# EAGLE board flight_controller_v1.0 (EAGLE 9.7.0)
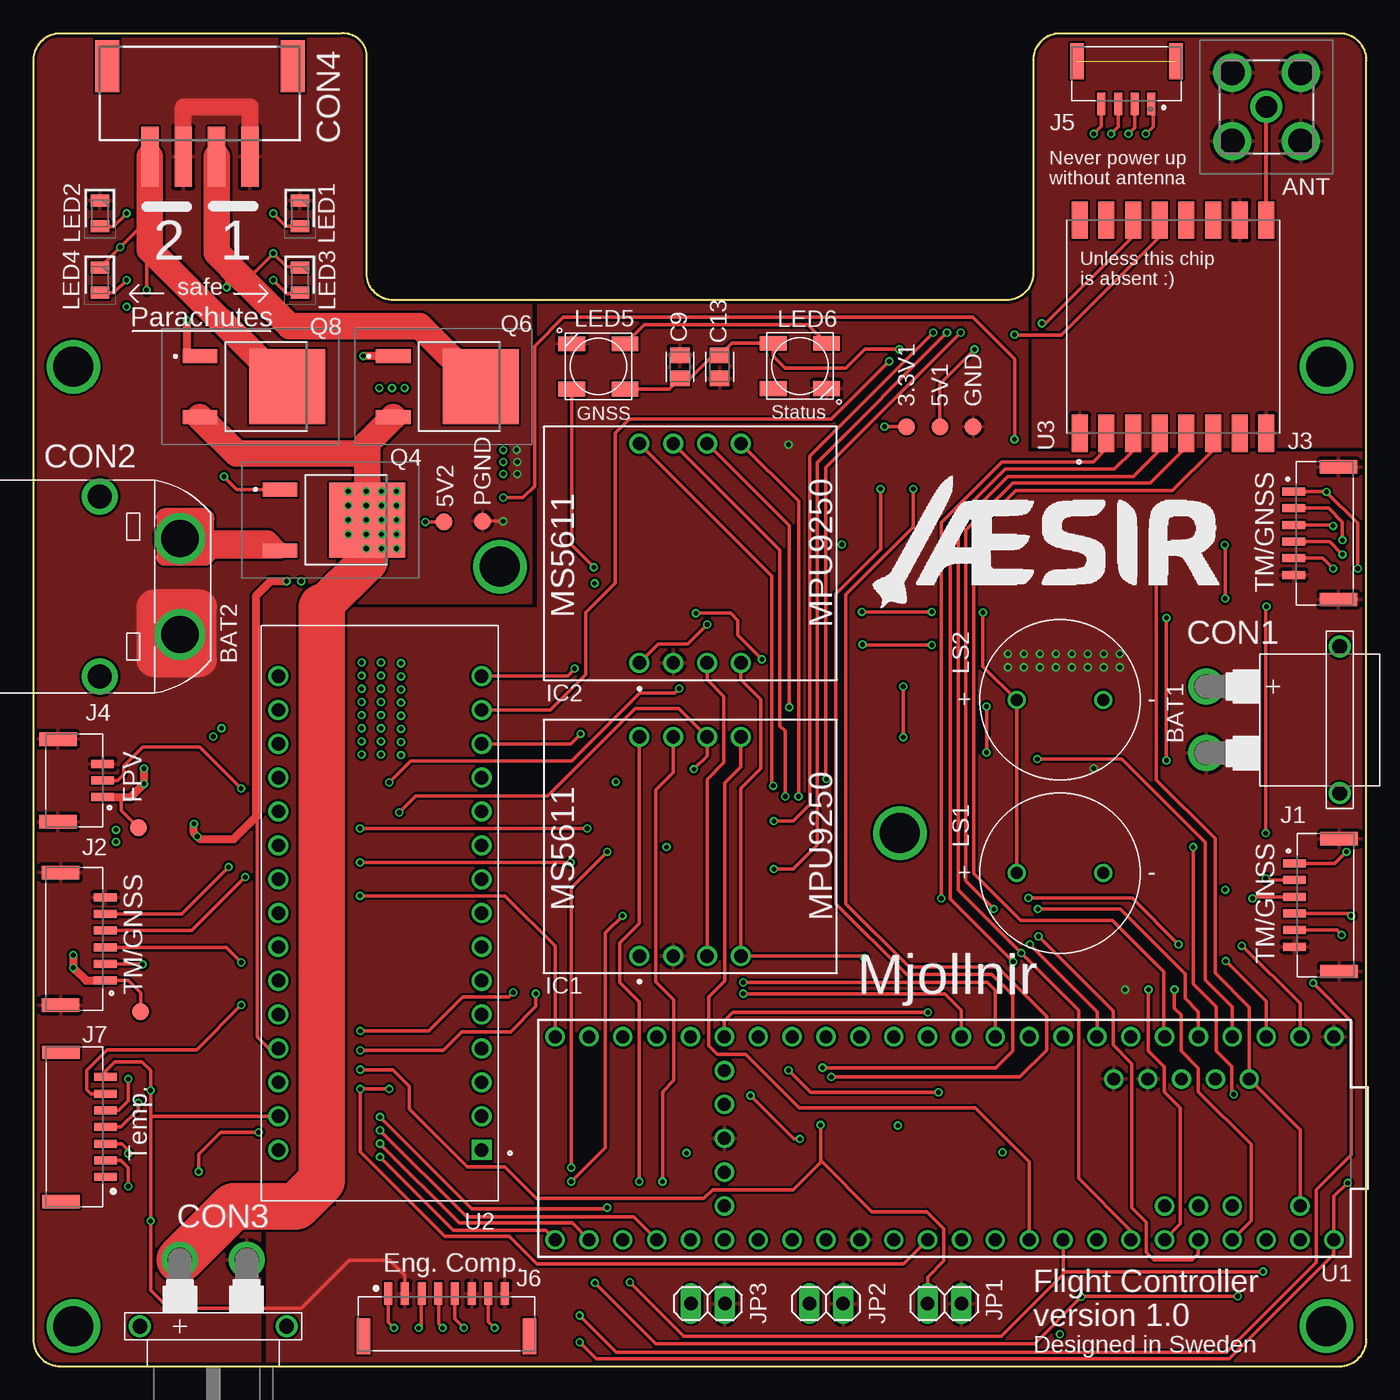
[diagram p6: board, top side]
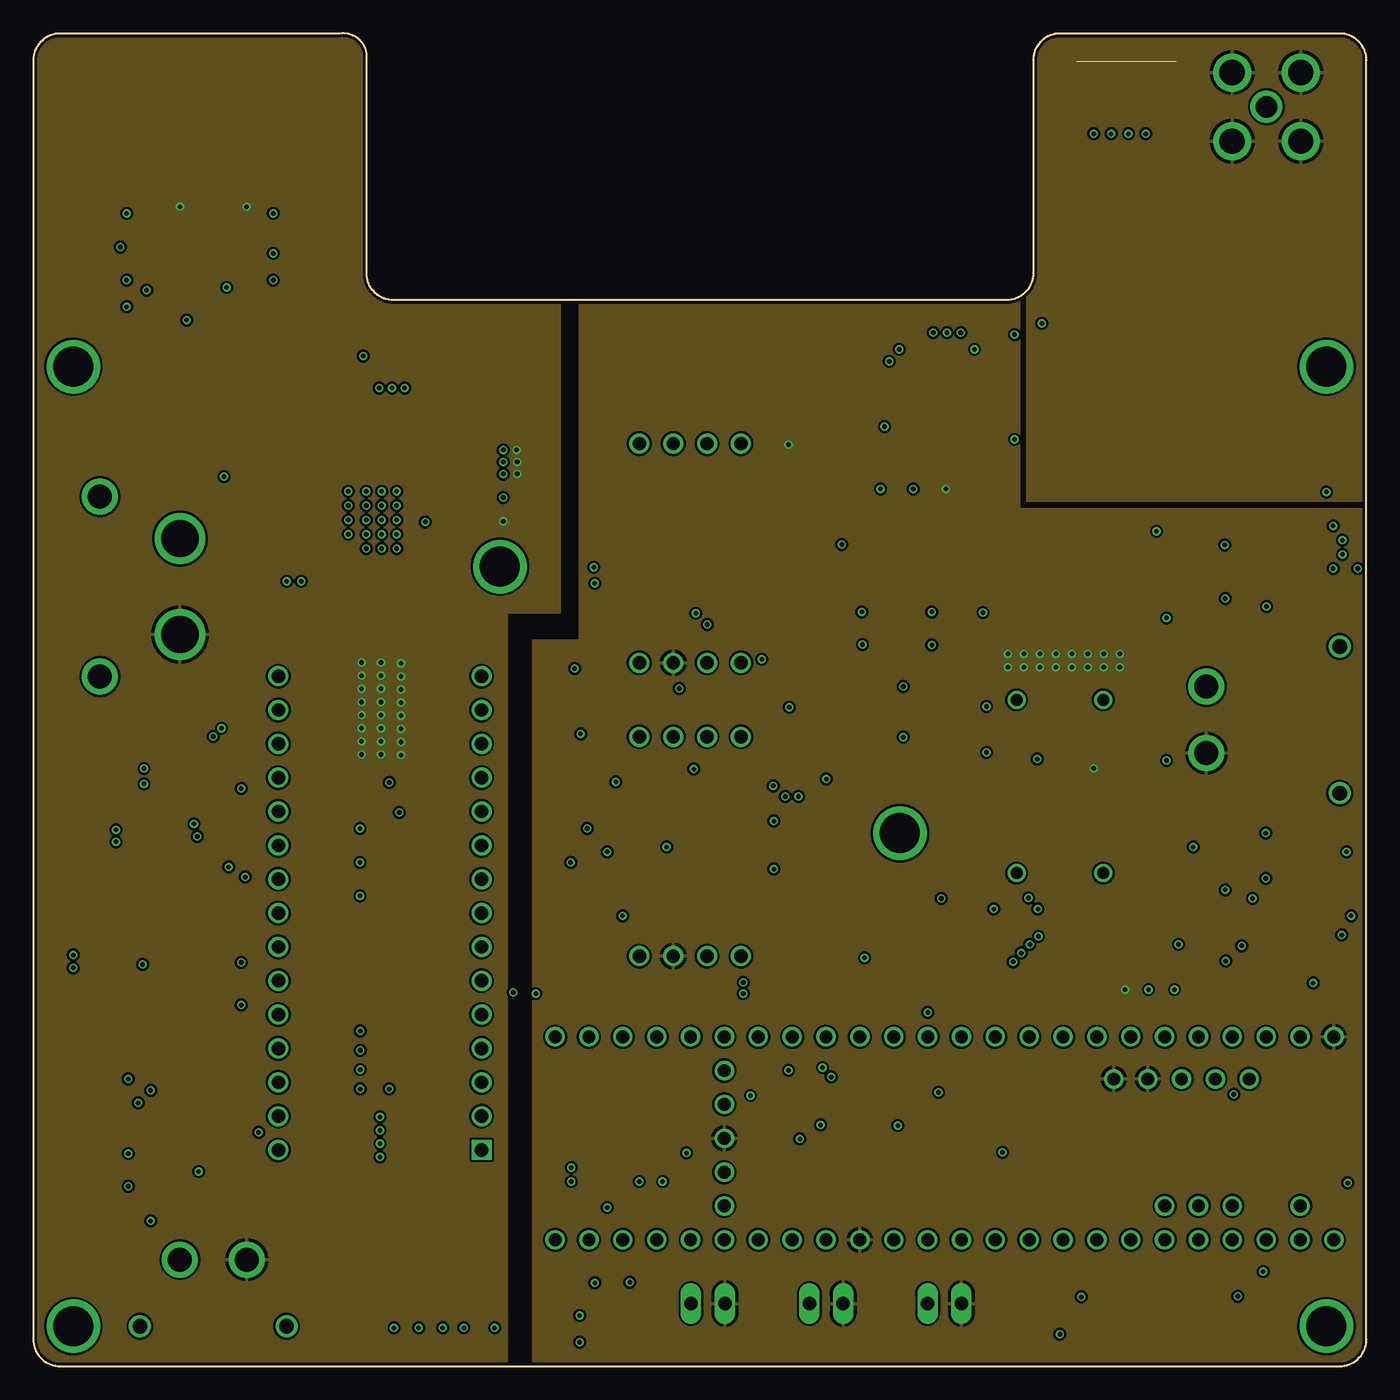
[diagram p7: board, inner layer Route2]
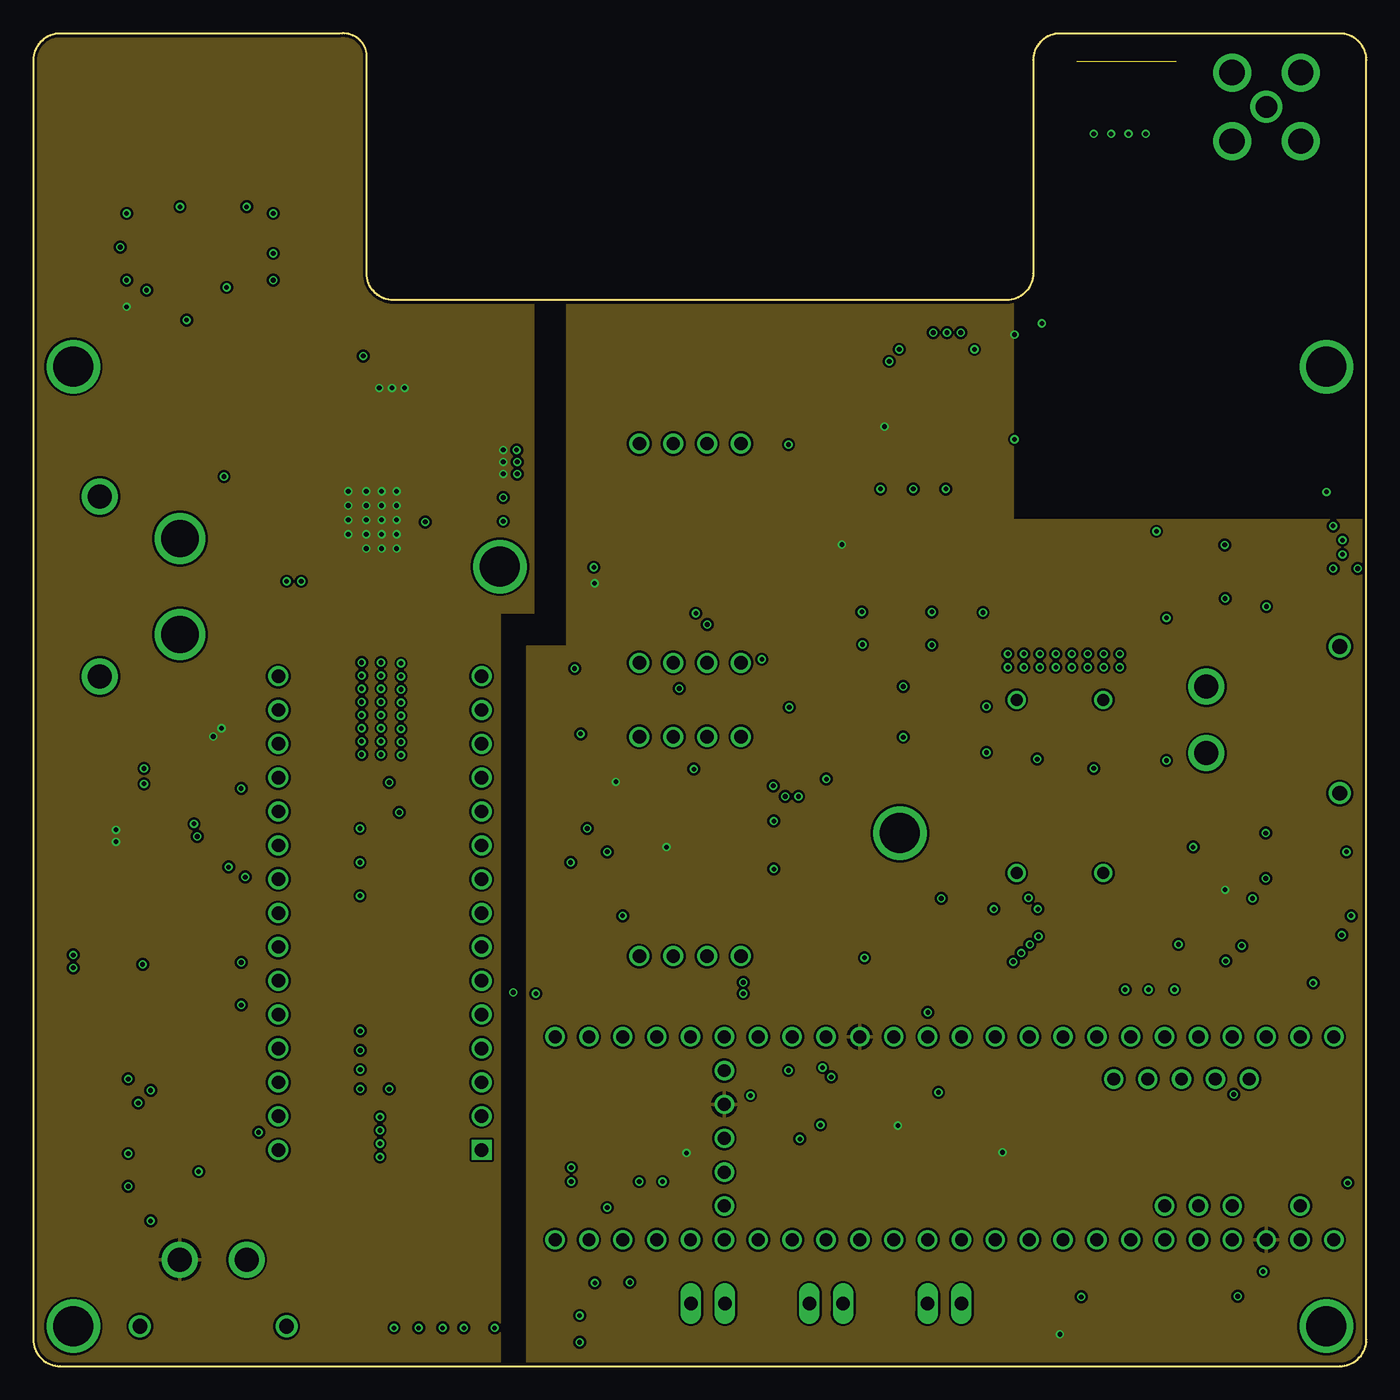
[diagram p8: board, inner layer Route15]
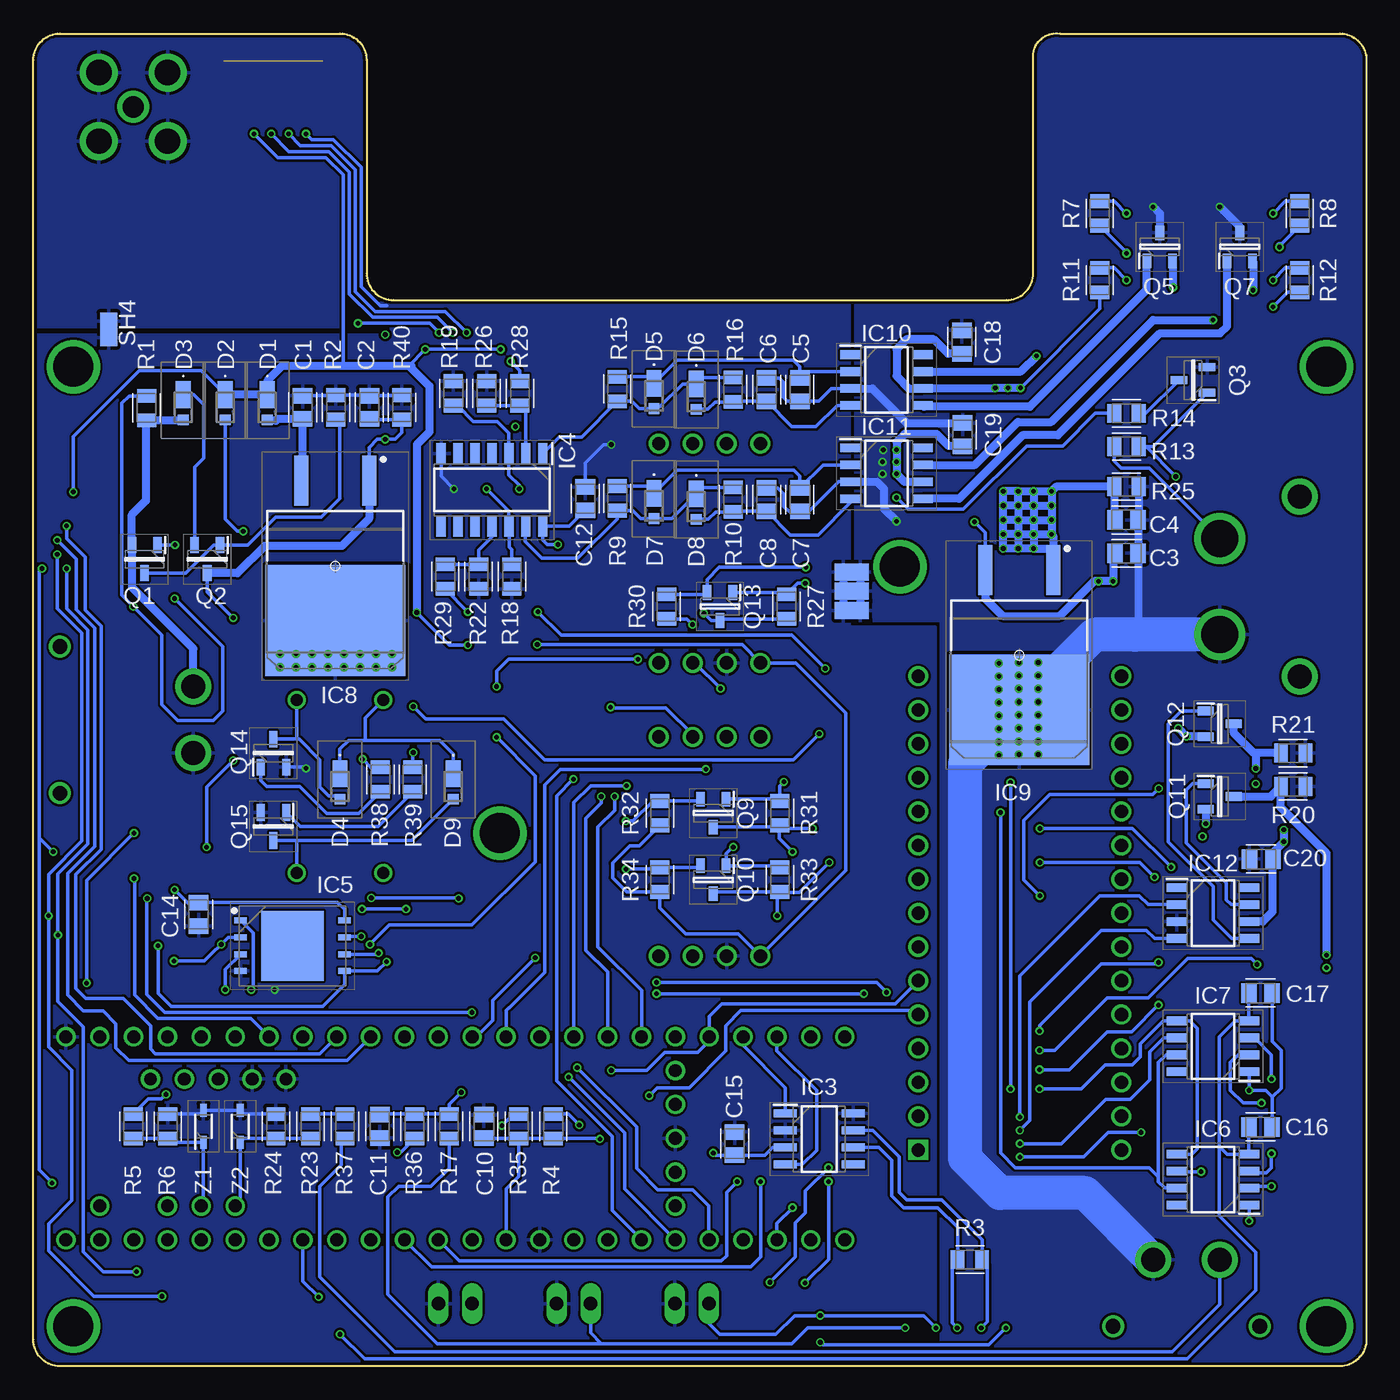
[diagram p9: board, bottom side, seen from below]

Size 100 x 100.02 mm. Coordinates in mm from the lower left corner, seen from the top.
Outline: 0,98 0,2 arc90 2,0 98,0 arc90 100,2 100,98 arc90 98,100 77,100 arc90 75,98 75,82 arc-90 73,80 27,80 arc-90 25,82 25,98.5 arc90 23,100 2,100 arc90 0,98
Copper layers (1+2*15+16): Top 0.035mm / dielectric 0.2mm / Route2 0.0175mm / dielectric 1.065mm / Route15 0.0175mm / dielectric 0.2mm / Bottom 0.035mm
Design rules "jlcpcb2layer *": minimum track width 5mil, minimum drill 0.2mm, track to track 7mil, track to pad 0.25mm, pad to pad 0.152mm, via to via 0.2mm, smd to smd 0mil, copper to edge 0.2mm, drill to drill 0.5mm, minimum pad ring 0.13mm, minimum via ring 0.13mm, stop-mask expansion 0.05mm, vias tented up to drill 100mil, thermal gap 10mil

## Footprints (pad centres in the part's own frame; a part is rotated, then mirrored left to right if it is on the bottom)
B1,27 = smd 1.27 x 1.27: TP 0,0
PCBRPSMAFRAHT = drill 1.6 pad 2.4: 1 0,0 | drill 1.9 pad 2.85: 2 -2.575,2.575; 3 -2.575,-2.575; 4 2.575,-2.575; 5 2.575,2.575
CAPC2012X110 = smd 1.165 x 1.465: 1 -0.875,0; 2 0.875,0
XT30PW-M = drill 1.8: + -2.5,0; - 2.5,0 | drill 1.1: P$3 -5.5,10; P$4 5.5,10
XT60PW-M = drill 2.8: + 3.6,0; - -3.6,0 | drill 1.8: P$3 -6.75,6; P$4 6.75,6
XT30PW-F = drill 1.8: + 2.5,0; - -2.5,0 | drill 1.1: P$3 -5.5,5; P$4 5.5,5
S4B-XH-SM4-TB = smd 1.3 x 4.5: 1 -3.75,1.25; 2 -1.25,1.25; 3 1.25,1.25; 4 3.75,1.25 | smd 1.8 x 3.9: 5 6.95,-5.55; 6 -6.95,-5.55
MSS2P3M389A = smd 2 x 1.1: 1 -0.95,0 | smd 0.8 x 0.8: 2 0.95,0
2X4PIN = drill 1: P$1 -8.225,5.08; P$2 -8.225,2.54; P$3 -8.225,0; P$4 -8.225,-2.54; P$5 8.225,-2.54; P$6 8.225,0; P$7 8.225,2.54; P$8 8.225,5.08
SOT127P600X175-8N = smd 1.75 x 0.6: 1 -2.55,1.905; 2 -2.55,0.635; 3 -2.55,-0.635; 4 -2.55,-1.905; 5 2.55,-1.905; 6 2.55,-0.635; 7 2.55,0.635; 8 2.55,1.905
SOIC127P600X175-14N = smd 1.55 x 0.7: 1 -2.725,3.81; 2 -2.725,2.54; 3 -2.725,1.27; 4 -2.725,0; 5 -2.725,-1.27; 6 -2.725,-2.54; 7 -2.725,-3.81; 8 2.725,-3.81; 9 2.725,-2.54; 10 2.725,-1.27; 11 2.725,0; 12 2.725,1.27; 13 2.725,2.54; 14 2.725,3.81
SON127P800X600X80-9N = smd 0.95 x 0.45: 1 -3.9,1.905; 2 -3.9,0.635; 3 -3.9,-0.635; 4 -3.9,-1.905; 5 3.9,-1.905; 6 3.9,-0.635; 7 3.9,0.635; 8 3.9,1.905 | smd 4.7 x 5.25: 9 0,0
SOIC127P600X175-8N = smd 1.525 x 0.65: 1 -2.712,1.905; 2 -2.712,0.635; 3 -2.712,-0.635; 4 -2.712,-1.905; 5 2.712,-1.905; 6 2.712,-0.635; 7 2.712,0.635; 8 2.712,1.905
TO254P1542X460-3N = smd 3.75 x 1.05: 1 -6.4,2.54; 3 -6.4,-2.54 | smd 8.3 x 10.5: 4 4.1,0
JST_BM06B-GHS-TBT(LF)(SN)(N) = smd 0.6 x 1.7: 1 3.125,3.35; 2 1.875,3.35; 3 0.625,3.35; 4 -0.625,3.35; 5 -1.875,3.35; 6 -3.125,3.35 | smd 1 x 2.8: S1 -4.975,0; S2 4.975,0
CONN_BM03B-GHS-TBT(LF)(SN)(N) = smd 0.6 x 1.7: 1 1.25,0; 2 0,0; 3 -1.25,0 | smd 1 x 2.8: 4 3.1,-3.35; 5 -3.1,-3.35
JST_SM04B-GHS-TB(LF)(SN)- = smd 0.6 x 1.7: 1 -1.875,2.275; 2 -0.625,2.275; 3 0.625,2.275; 4 1.875,2.275 | smd 1 x 2.7: SH1 -3.725,-0.925; SH2 3.725,-0.925
JST_SM08B-GHS-TB(LF)(SN) = smd 0.6 x 1.7: 1 -4.375,0; 2 -3.125,0; 3 -1.875,0; 4 -0.625,0; 5 0.625,0; 6 1.875,0; 7 3.125,0; 8 4.375,0 | smd 1 x 2.7: SH1 -6.225,-3.2; SH2 6.225,-3.2
BM07B-GHS-TBT = smd 0.6 x 1.7: 1 3.75,0.2; 2 2.5,0.2; 3 1.25,0.2; 4 0,0.2; 5 -1.25,0.2; 6 -2.5,0.2; 7 -3.75,0.2 | smd 1 x 2.8: 8 -5.6,-3.15; 9 5.6,-3.15
1X02 = drill 1.016 long: 1 -1.27,0; 2 1.27,0
LEDC2012X80N = smd 0.9 x 1.4: 1 -0.95,0; 2 0.95,0
WS2812B = smd 2 x 1.1: DIN 2,1.7; DOUT -2,-1.7; VDD -2,1.7; VSS 2,-1.7
CUI_CEM-1206S = drill 0.9: N 3.25,0; P -3.25,0
SOT96P240X120-3N = smd 1.2 x 0.65: 1 -1.05,0.96; 2 -1.05,-0.96; 3 1.05,0
SOT96P237X111-3N = smd 1.25 x 0.6: 1 -1.05,0.955; 2 -1.05,-0.955; 3 1.05,0
SBR6100CTL13 = smd 1.06 x 2.6: 1 -2.286,0; 3 2.286,0 | smd 5.632 x 5.7: 2 0,6.55
SOT96P240X110-3N = smd 1.1 x 0.65: 1 -1.05,0.96; 2 -1.05,-0.96; 3 1.05,0
RESC2012X65 = smd 1.031 x 1.42: 1 -0.919,0; 2 0.919,0
SHORT_TOP-50 = smd 1.27 x 1.27: 1 0.635,0; 2 -0.635,0
TEENSY_3.6_ALL_PINS = drill 0.965: 0 -7.62,25.4; 1 -7.62,22.86; 2 -7.62,20.32; 3 -7.62,17.78; 3.3V 7.62,22.86; 3.3V3 -7.62,-7.62; 3.3V4 -2.54,-17.78; 4 -7.62,15.24; 5 -7.62,12.7; 6 -7.62,10.16; 7 -7.62,7.62; 8 -7.62,5.08; 9 -7.62,2.54; 10 -7.62,0; 11 -7.62,-2.54; 12 -7.62,-5.08; 13 7.62,-5.08; 14/A0 7.62,-2.54; 15/A1 7.62,0; 16/A2 7.62,2.54; 17/A3 7.62,5.08; 18/A4 7.62,7.62; 19/A5 7.62,10.16; 20/A6 7.62,12.7; 21/A7 7.62,15.24; 22/A8 7.62,17.78; 23/A9 7.62,20.32; 24 -7.62,-10.16; 25 -7.62,-12.7; 26 -7.62,-15.24; 27 -7.62,-17.78; 28 -7.62,-20.32; 29 -7.62,-22.86; 30 -7.62,-25.4; 31/A12 -7.62,-27.94; 32/A13 -7.62,-30.48; 33/A14 7.62,-30.48; 34/A15 7.62,-27.94; 35/A16 7.62,-25.4; 36/A17 7.62,-22.86; 37/A18 7.62,-20.32; 38/A19 7.62,-17.78; 39/A20 7.62,-15.24; A10 5.08,17.78; A11 5.08,15.24; A21 7.62,-12.7; A22 7.62,-10.16; AGND 7.62,25.4; AREF 5.08,20.32; D+ -4.445,16.51; D- -4.445,19.05; GND -7.62,27.94; GND1 7.62,-7.62; GND3 -4.445,13.97; GND4 -4.445,11.43; GND6 0,-17.78; PGM 2.54,-17.78; RESET 5.08,-17.78; VBAT -5.08,-17.78; VIN 7.62,27.94; VUSB 5.08,25.4; VUSB1 -4.445,21.59
MODULE_A000005 = drill 1 square: 1 -7.62,17.78 | drill 1: 2 -7.62,15.24; 3 -7.62,12.7; 4 -7.62,10.16; 5 -7.62,7.62; 6 -7.62,5.08; 7 -7.62,2.54; 8 -7.62,0; 9 -7.62,-2.54; 10 -7.62,-5.08; 11 -7.62,-7.62; 12 -7.62,-10.16; 13 -7.62,-12.7; 14 -7.62,-15.24; 15 -7.62,-17.78; 16 7.62,-17.78; 17 7.62,-15.24; 18 7.62,-12.7; 19 7.62,-10.16; 20 7.62,-7.62; 21 7.62,-5.08; 22 7.62,-2.54; 23 7.62,0; 24 7.62,2.54; 25 7.62,5.08; 26 7.62,7.62; 27 7.62,10.16; 28 7.62,12.7; 29 7.62,15.24; 30 7.62,17.78
XCVR_RFM98W-433S2 = smd 2.8 x 1.2: 1 -8,7; 2 -8,5; 3 -8,3; 4 -8,1; 5 -8,-1; 6 -8,-3; 7 -8,-5; 8 -8,-7; 9 8,-7; 10 8,-5; 11 8,-3; 12 8,-1; 13 8,1; 14 8,3; 15 8,5; 16 8,7
SOD2512X110N = smd 1 x 0.5: 1 -1.2,0; 2 1.2,0

## Placement (x,y rotation side)
3.3V1  TPB1,27  [B1,27]  65.5,70.5 0 top
5V1  TPB1,27  [B1,27]  68,70.5 0 top
5V2  TPB1,27  [B1,27]  30.8,63.35 0 top
ANT  PCB.RPSMAFRA.HT  [PCBRPSMAFRAHT]  92.5,94.5 0 top
C1  0.1u  [CAPC2012X110]  79.8,71.95 90 bottom
C2  0.1u  [CAPC2012X110]  74.8,71.95 270 bottom
C3  0.1u  [CAPC2012X110]  18,61 0 bottom
C4  0.1u  [CAPC2012X110]  18,63.5 180 bottom
C5  0.1u  [CAPC2012X110]  42.5,73.28 270 bottom
C6  0.1u  [CAPC2012X110]  44.99,73.28 90 bottom
C7  0.1u  [CAPC2012X110]  42.5,65.03 270 bottom
C8  0.1u  [CAPC2012X110]  44.99,65.03 90 bottom
C9  0.1u  [CAPC2012X110]  48.5,74.99 90 top
C10  0.1u  [CAPC2012X110]  66.2,18 90 bottom
C11  0.1u  [CAPC2012X110]  74.01,18 270 bottom
C12  0.1u  [CAPC2012X110]  58.6,65.1 270 bottom
C13  0.1u  [CAPC2012X110]  51.48,74.99 270 top
C14  0.1u  [CAPC2012X110]  87.6,33.9 270 bottom
C15  0.1u  [CAPC2012X110]  47.4,16.7 90 bottom
C16  0.1u  [CAPC2012X110]  7.95,17.95 180 bottom
C17  0.1u  [CAPC2012X110]  7.95,28 180 bottom
C18  0.1u  [CAPC2012X110]  30.35,76.85 270 bottom
C19  0.1u  [CAPC2012X110]  30.3,69.9 270 bottom
C20  0.1u  [CAPC2012X110]  7.9,38.05 0 bottom
CON1  XT30PW-M  [XT30PW-M]  88,48.5 270 top
CON2  XT60PW-M  [XT60PW-M]  11,58.5 90 top
CON3  XT30PW-F  [XT30PW-F]  13.5,8 180 top
CON4  S4B-XH-SM4-TB_LF__SN_  [S4B-XH-SM4-TB]  12.5,92 180 top
D1  MSS2P3-M3_89A  [MSS2P3M389A]  82.45,71.95 270 bottom
D2  MSS2P3-M3_89A  [MSS2P3M389A]  85.6,71.95 270 bottom
D3  MSS2P3-M3_89A  [MSS2P3M389A]  88.75,71.95 270 bottom
D4  MSS2P3-M3_89A  [MSS2P3M389A]  77,43.5 270 bottom
D5  MSS2P3-M3_89A  [MSS2P3M389A]  53.44,72.8 270 bottom
D6  MSS2P3-M3_89A  [MSS2P3M389A]  50.27,72.75 270 bottom
D7  MSS2P3-M3_89A  [MSS2P3M389A]  53.44,64.55 270 bottom
D8  MSS2P3-M3_89A  [MSS2P3M389A]  50.27,64.5 270 bottom
D9  MSS2P3-M3_89A  [MSS2P3M389A]  68.5,43.5 270 bottom
GND  TPB1,27  [B1,27]  70.5,70.5 0 top
IC1  MPU9250_MS5611  [2X4PIN]  48,39 270 top
IC2  MPU9250_MS5611  [2X4PIN]  48,61 270 top
IC3  SN65HVD230DR  [SOT127P600X175-8N]  41.05,17.05 0 bottom
IC4  74HC02D,653  [SOIC127P600X175-14N]  65.6,65.75 270 bottom
IC5  W25N01GVZEIG  [SON127P800X600X80-9N]  80.55,31.55 0 bottom
IC6  MAX31855KASA+T  [SOIC127P600X175-8N]  11.5,14 180 bottom
IC7  MAX31855KASA+T  [SOIC127P600X175-8N]  11.5,24 180 bottom
IC8  L7805CD2T-TR  [TO254P1542X460-3N]  77.35,60.05 270 bottom
IC9  L7805CD2T-TR  [TO254P1542X460-3N]  26.05,53.35 270 bottom
IC10  IX4340N  [SOIC127P600X175-8N]  36,74 0 bottom
IC11  IX4340N  [SOIC127P600X175-8N]  36,67 0 bottom
IC12  IX4340N  [SOIC127P600X175-8N]  11.5,34 0 bottom
J1  BM06B-GHS-TBT(LF)(SN)(N)  [JST_BM06B-GHS-TBT(LF)(SN)(N)]  97.95,34.6 90 top
J2  BM06B-GHS-TBT(LF)(SN)(N)  [JST_BM06B-GHS-TBT(LF)(SN)(N)]  2.05,32.06 270 top
J3  BM06B-GHS-TBT(LF)(SN)(N)  [JST_BM06B-GHS-TBT(LF)(SN)(N)]  97.9,62.5 90 top
J4  BM03B-GHS-TBT(LF)(SN)(N)  [CONN_BM03B-GHS-TBT(LF)(SN)(N)]  5.2,43.95 270 top
J5  SM04B-GHS-TB(LF)(SN)-  [JST_SM04B-GHS-TB(LF)(SN)-]  82,97 180 top
J6  SM08B-GHS-TB(LF)(SN)  [JST_SM08B-GHS-TB(LF)(SN)]  31,5.45 0 top
J7  BM07B-GHS-TBT_LF__SN__N_  [BM07B-GHS-TBT]  5.22,17.95 270 top
JP1  PINHD-1X2  [1X02]  68.35,4.7 180 top
JP2  PINHD-1X2  [1X02]  59.48,4.7 180 top
JP3  PINHD-1X2  [1X02]  50.6,4.7 180 top
LED1  150080RS75000  [LEDC2012X80N]  20,86.5 270 top
LED2  150080RS75000  [LEDC2012X80N]  5,86.5 270 top
LED3  150080VS75000  [LEDC2012X80N]  20,81.5 270 top
LED4  150080VS75000  [LEDC2012X80N]  5,81.5 270 top
LED5  WS2812B  [WS2812B]  42.39,75.02 180 top
LED6  WS2812B  [WS2812B]  57.5,75.05 0 top
LS1  CEM-1206S  [CUI_CEM-1206S]  77,37 0 top
LS2  CEM-1206S  [CUI_CEM-1206S]  77,50 0 top
PGND  TPB1,27  [B1,27]  33.7,63.4 0 top
Q1  DMP3099L-7  [SOT96P240X120-3N]  91.65,60.55 270 bottom
Q2  DMP3099L-7  [SOT96P240X120-3N]  86.95,60.55 270 bottom
Q3  MMBT2222ALT1G  [SOT96P237X111-3N]  13,74 180 bottom
Q4  DMP4010SK3Q-13  [SBR6100CTL13]  18.5,63.5 270 top
Q5  DMN6140LQ-7  [SOT96P240X110-3N]  15.5,84 90 bottom
Q6  DMP4010SK3Q-13  [SBR6100CTL13]  27,73.5 270 top
Q7  DMN6140LQ-7  [SOT96P240X110-3N]  9.5,84 90 bottom
Q8  DMP4010SK3Q-13  [SBR6100CTL13]  12.5,73.5 270 top
Q9  DMN6140LQ-7  [SOT96P240X110-3N]  49,41.5 270 bottom
Q10  DMN6140LQ-7  [SOT96P240X110-3N]  49,36.5 270 bottom
Q11  DMP3099L-7  [SOT96P240X120-3N]  11,42.75 0 bottom
Q12  DMP3099L-7  [SOT96P240X120-3N]  11,48.2 0 bottom
Q13  DMN6140LQ-7  [SOT96P240X110-3N]  48.5,57 270 bottom
Q14  MMBT2222ALT1G  [SOT96P237X111-3N]  82,46 90 bottom
Q15  MMBT2222ALT1G  [SOT96P237X111-3N]  82,40.5 270 bottom
R1  10k  [RESC2012X65]  91.5,71.9 270 bottom
R2  10k  [RESC2012X65]  77.3,71.95 270 bottom
R3  120  [RESC2012X65]  29.75,8 0 bottom
R4  1k  [RESC2012X65]  61,18 90 bottom
R5  10k  [RESC2012X65]  92.5,18 90 bottom
R6  4.7k  [RESC2012X65]  89.91,18 270 bottom
R7  470  [RESC2012X65]  20,86.5 270 bottom
R8  470  [RESC2012X65]  5,86.5 270 bottom
R9  1k  [RESC2012X65]  56.2,65.12 90 bottom
R10  1k  [RESC2012X65]  47.51,65.03 270 bottom
R11  470  [RESC2012X65]  20,81.5 270 bottom
R12  470  [RESC2012X65]  5,81.5 270 bottom
R13  10k  [RESC2012X65]  18,69 180 bottom
R14  10k  [RESC2012X65]  18,71.5 0 bottom
R15  1k  [RESC2012X65]  56.2,73.33 90 bottom
R16  1k  [RESC2012X65]  47.51,73.28 270 bottom
R17  1k  [RESC2012X65]  68.81,18 270 bottom
R18  10k  [RESC2012X65]  64.1,59.25 90 bottom
R19  10k  [RESC2012X65]  68.5,73 270 bottom
R20  10k  [RESC2012X65]  5.5,43.5 180 bottom
R21  10k  [RESC2012X65]  5.5,46 180 bottom
R22  10k  [RESC2012X65]  66.6,59.25 90 bottom
R23  10k  [RESC2012X65]  79.21,18 90 bottom
R24  4.7k  [RESC2012X65]  81.8,18 270 bottom
R25  10k  [RESC2012X65]  18,66 180 bottom
R26  10k  [RESC2012X65]  66,73 270 bottom
R27  10k  [RESC2012X65]  43.5,57 90 bottom
R28  4.7k  [RESC2012X65]  63.5,73 270 bottom
R29  4.7k  [RESC2012X65]  69.1,59.25 90 bottom
R30  10k  [RESC2012X65]  52.5,57 270 bottom
R31  10k  [RESC2012X65]  44,41.5 90 bottom
R32  10k  [RESC2012X65]  53,41.5 270 bottom
R33  10k  [RESC2012X65]  44,36.5 90 bottom
R34  10k  [RESC2012X65]  53,36.5 270 bottom
R35  10k  [RESC2012X65]  63.59,18 90 bottom
R36  10k  [RESC2012X65]  71.4,18 270 bottom
R37  10k  [RESC2012X65]  76.62,18 270 bottom
R38  1k  [RESC2012X65]  73.96,44.02 90 bottom
R39  1k  [RESC2012X65]  71.54,44.02 90 bottom
R40  10k  [RESC2012X65]  72.35,71.95 270 bottom
SH1  SHORT-HT5  [SHORT_TOP-50]  38.6,59.6 180 bottom
SH2  SHORT-HT5  [SHORT_TOP-50]  38.6,58.15 180 bottom
SH3  SHORT-HT5  [SHORT_TOP-50]  38.6,56.7 180 bottom
SH4  SHORT-HT5  [SHORT_TOP-50]  94.35,77.8 90 bottom
TP1  TPB1,27  [B1,27]  7.9,40.4 0 top
TP2  TPB1,27  [B1,27]  8.05,26.6 0 top
U1  TEENSY_3.6_ALL_PINS  [TEENSY_3.6_ALL_PINS]  69.62,17.1 270 top
U2  ARDUINO_NANO_3  [MODULE_A000005]  26,34 180 top
U3  RFM98W-433S2  [XCVR_RFM98W-433S2]  85.5,78 90 top
Z1  MM3Z3V0ST1G  [SOD2512X110N]  87.24,18 90 bottom
Z2  MM3Z3V0ST1G  [SOD2512X110N]  84.47,18 90 bottom

## Tracks (layer width: path | path; a pad name or v marks a point on that pad's centre or on a via)
3.3V1  (via drill 0.35)
  Top 0.254: U3.13 84.5,84.75 77.1,77.35 73.65,77.35 v73.6,77.4 | 3.3V1.TP v63.85,70.5 v63.84,70.51
  Bottom 0.254: Q9.1 44.13,42.55 R31.2 44,43.55 v43.7,43.85 | R33.2 44.13,37.55 Q10.1 48.04,38.46 47.55,38.95 v47.5,38.95 | 11.05,16.5 10.46,15.9 IC6.4 8.82,15.94 C16.2 | 11.05,16.5 11.05,11.3 8.3,8.55 8.3,5.7 13.45,0.55 75.15,0.55 v77,2.4 | C12.2 59.8,63.02 IC4.14 61.79,61.99 61.45,61.65 v60.65,61.65 | IC3.3 44.53,16.41 45.12,15.82 C15.1 48.83,15.82 v49,16 | 11.05,16.5 11.05,24.7 9.85,25.91 IC7.4 8.82,25.94 C17.2 | v42.1,58.75 42.67,58.75 R27.2 43.63,58.05 Q13.1 | R35.2 63.98,18.92 v64.85,18.05 | R36.2 72.43,16.05 v72.7,16.05 | v89.4,35.75 88.42,34.77 C14.1 87.57,34.8 77.19,34.8 76.65,34.26 IC5.8
  pour Route15: 40,85 40,54 37,54 37,-7 110,-7 110,63.5 73.5,63.5 73.5,85
5V1  (via drill 0.35)
  Top 0.254: J5.1 84,94.6 84,93.03 v83.45,92.47 | J6.1 26.62,3.3 v27.05,2.88 | v40.98,1.8 42.23,0.55 89.7,0.55 97.56,8.41 U1.VIN 97.56,12.73 98.58,13.75 v98.6,13.75 | LS1.P LS2.P 71.24,52.51 v71.24,56.55 | J3.1 96.97,65.62 v97,65.6 99.35,63.25 v99.35,59.85 | J1.1 97.62,37.73 v98.5,38.6 | IC2.P$5 46.88,54.2 49.1,54.2 v50.55,55.65 | v67.4,54.11 62.24,54.11 v62.2,54.15 | v64.95,76.3 62.35,76.3 60.95,74.9 56.4,74.9 55.5,75.8 LED6.VDD 52.37,76.75 C13.1 50.98,75.86 49.23,74.11 C9.1 47.72,73.32 LED5.VDD | 5V1.TP 68,73.7 v70.6,76.3 | v70.6,76.3
  Bottom 0.254: v27.05,2.88 28.32,1.6 40.77,1.6 v40.98,1.8 | D4.1 77,46.3 76.35,46.95 75.1,46.95 | 75.1,46.95 69.5,46.95 68.5,45.95 D9.1 | D2.1 87.4,74.7 92.05,74.7 97,69.75 v97,65.6 | v64.95,76.3 v70.6,76.3 71.85,75.05 | 71.65,75.05 71.72,74.97 | R32.2 54.53,39.05 55.25,39.05 56.55,37.75 56.55,36.65 55.48,35.58 R34.2 53,34.38 51.07,32.45 47.13,32.45 IC1.P$5 39.05,37.19 39.05,49.02 42.81,52.77 IC2.P$5 46.84,54.15 53.3,54.15 v62.2,54.15 | v83.45,92.47 81.67,90.7 78.05,90.7 76.75,89.4 76.75,75.05 | 99.55,39.65 v98.5,38.6 | v99.35,59.85 99.55,59.65 99.55,39.65 | v50.55,55.65 50.98,56.08 R30.2 | v98.6,13.75 98.6,13.8 99.55,14.75 99.55,39.65 | LS2.P 75.1,48.65 75.1,46.95 | v67.4,54.11 68.8,54.11 v71.24,56.55
  Bottom 0.61: D2.1 D1.1 82.45,73.95 81.35,75.05 76.75,75.05 71.85,75.05 71.65,75.05 | 71.72,74.97 70.3,73.55 70.3,70.1 71.24,69.16 v71.24,56.55
5V2  (via drill 0.35)
  Top 0.254: U2.27 17.66,23.84 16.8,24.7 16.8,41.3 | 5V2.TP v29.4,63.35
  Top 0.61: v19,58.9 17.8,58.9 16.7,57.8 16.7,41.2 | v12.05,40.7 12.05,40 v12.3,39.75 12.5,39.55 15.05,39.55 16.7,41.2 | 16.7,41.2 16.8,41.3
  Bottom 0.254: v29.4,63.35 28.59,62.54 IC9.3
  Bottom 0.61: C3.1 19,60.88 v19,58.9 v20.1,58.9 20.4,58.9 23,56.3 27.3,56.3 28.59,57.59 IC9.3 | Q11.2 v12.05,40.7
A10
  Bottom 0.254: R5.1 R6.2 89.91,16.8 Z1.1 87.24,12.18 U1.A10
A11
  Bottom 0.254: R23.1 R24.2 84.19,17.08 Z2.1 84.47,12.02 U1.A11
BAT1+
  Bottom 0.61: CON1.+ 88,53.85 92.6,58.45 Q1.2 92.61,63.9 91.56,64.95 91.56,71 91.52,71 | R1.2 91.52,71 | 91.52,71 D3.2
BAT1_OUT  (via drill 0.35)
  Top 0.254: v35.25,65.17 36.73,65.17 37.6,66.05 37.6,76.55 39.75,78.7 70.45,78.7 73.6,75.55 v73.6,69.55 | v87,38.95 87,28.7 88.75,26.95 88.75,23.65 89.9,22.5 89.9,20.5 90,20.4 v90.05,20.4 | v85,45.45 v85,56.15
  Bottom 0.254: 74.76,71.03 R40.2 72.35,70.05 72.85,69.55 v73.6,69.55 74.2,69.55 74.81,68.94 IC8.1 | R14.1 20.35,71.5 22.8,69.05 25.5,69.05 30.25,64.3 34.38,64.3 v35.25,65.17 | Q2.3 86.95,58.1 v85,56.15 | v90.05,20.4 90.4,20.05 91.37,20.05 R5.2 | v85,45.45 87,43.45 v87,38.95
  Bottom 0.61: 74.76,71.03 C2.2 | IC8.1 74.81,63.59 76.85,61.55 82.65,61.55 84.7,59.5 Q2.3
BAT2+
  Top 1.27: 12.95,61.66 12.95,63.65 12.85,63.75 12.4,63.75 | 12.4,63.75 9.85,63.75 9.85,60.7 12.89,60.7 13.4,61.21 Q4.3 17.61,62.1 CON2.+ | 12.4,63.5 12.4,63.75 | CON2.+ 11.6,61.5 11.95,61.5 11.95,61.8 10.9,62.85 10.65,62.85 10.65,62.95 | CON2.+ 11.05,62.1 11.8,62.85 11.95,62.7 10.53,61.27
  Bottom 0.254: CON2.+ 16.28,67.38 18.38,67.38 18.92,67.92 R13.2
BAT2_OUT  (via drill 0.35)
  Top 0.61: Q4.2 26.55,65
  Top 2: 24.14,61.26 25.05,60.35 | Q4.2 25.05,68.46 | 25.05,68.46 25.05,69.26 Q6.3 | Q8.3 15.25,68.46 25.05,68.46
  Top 2.54: 25.05,60.35 Q4.2
  Top 3: 21.65,56.95 25.05,60.35
  Top 3.5: CON3.+ 14.98,11.98 19.73,11.98 21.65,13.9 21.65,56.95
  Bottom 0.254: v25.95,73.4 20,79.35 R11.2 | R12.2 5.92,80.58 v7,79.5 | CON3.+ 11,4.65 14.55,1.1 72.9,1.1 78.5,6.7 78.5,13.5 76.9,15.1 76.9,16.8 R37.2
  Bottom 0.61: v25.95,73.4 v26.9,73.4 v27.85,73.4 27.89,73.36 IC10.6 34.31,73.36 35.25,74.3 35.25,76.3 34.5,77.05 32.46,77.05 31.39,75.97 C18.2 | C4.2 18.88,65.96 R25.2 23.27,66 v23.62,65.65 | IC12.6 7.78,33.37 7.05,34.09 7.05,38.02 C20.2 7.03,38.52 v6.2,39.35 v6.2,40.25 | Q12.2 v13.49,47.24 v13.5,47.25 13.5,47.26 v14.11,47.88 | IC11.6 34.66,66.36 v35.25,66.95 v35.25,67.85 v35.25,68.75 35.25,69.35 34.65,69.95 32.25,69.95 31.35,69.05 30.32,69.05 C19.2 | v23.62,64.58 v23.62,63.5 | v23.62,62.42 23.51,62.31 23.51,61.35 | 23.51,61.35 IC9.1 | v23.62,65.65 v23.62,64.58 | v23.62,63.5 v23.62,62.42 | v24.98,65.65 v24.98,64.58 | v24.98,64.58 v24.98,63.5 | v24.98,63.5 v24.98,62.42 | v24.98,62.42 v24.98,61.35 | v24.98,65.65 v23.62,65.65 | v24.98,64.58 v23.62,64.58 | v24.98,63.5 v23.62,63.5 | v24.98,62.42 v23.62,62.42 | v24.98,61.35 v26.12,61.35 | v26.12,61.35 v27.25,61.35 v27.25,62.42 | v27.25,62.42 v27.25,63.5 | v27.25,63.5 v27.25,64.58 | v26.12,64.58 v27.25,64.58 | v26.12,64.58 v26.12,65.65 | v27.25,64.58 v27.25,65.65 v26.12,65.65 | v26.12,65.65 v24.98,65.65 | v26.12,64.58 v24.98,64.58 | v26.12,64.58 v26.12,63.5 | v26.12,63.5 v24.98,63.5 | v26.12,63.5 v27.25,63.5 | v26.12,63.5 v26.12,62.42 | v26.12,62.42 v24.98,62.42 | v26.12,62.42 v26.12,61.35 | v26.12,62.42 v27.25,62.42 | v24.98,61.35 23.51,61.35
  pour Route15: -12,105.5 37.5,105.5 37.5,56.5 35,56.5 35,-7.5 -12,-7.5
BUZZER_A  (via drill 0.35)
  Top 0.254: U2.13 40.3,46.7 v41.05,47.45 | v71.5,49.5 v71.5,46.05
  Bottom 0.254: v41.05,47.45 43,45.5 61.65,45.5 64.7,48.55 70.55,48.55 v71.5,49.5 | v71.5,46.05 71.54,46.01 R39.2
BUZZER_T  (via drill 0.35)
  Top 0.254: U1.2 89.94,26.96 87.9,29 87.9,39.3 81.65,45.55 v75.3,45.55
  Bottom 0.254: v75.3,45.55 74.69,44.94 R38.2
CAN0_RX
  Bottom 0.254: U1.30 44.22,23.67 41.25,20.7 41.25,16.2 42.3,15.14 IC3.4
CAN0_TX
  Bottom 0.254: U1.29 46.76,24.06 43.6,20.9 IC3.1
CAN_H  (via drill 0.35)
  Top 0.254: v28.9,2.88 29.1,3.08 29.1,5.42 J6.3
  Bottom 0.254: v28.9,2.88 28.43,3.35 28.43,7.6 R3.2 28.83,9.48 31.85,12.5 34.5,12.5 35.05,13.05 35.05,15.7 37.03,17.68 IC3.7
CAN_L  (via drill 0.35)
  Top 0.254: J6.4 30.4,5.47 30.4,3.17 v30.7,2.88
  Bottom 0.254: v30.7,2.88 31.07,3.24 31.07,7.6 R3.1 30.67,10.42 32.15,11.9 34.7,11.9 35.6,12.8 35.6,15.45 36.56,16.41 IC3.6
CH1
  Bottom 0.254: R16.1 49.77,74.19 D6.1 51.3,73.7 53,72 53.29,72 D5.2 54.54,71.85 55.1,72.41 R15.1 58.88,69.73 60.53,69.73 IC4.1
CH1_H
  Bottom 0.254: IC10.2 42.02,74.64 C5.1 42.5,75 43,75.5 51.69,75.5 D5.1 53.94,74.25 R15.2
CH1_L
  Bottom 0.254: IC10.4 39.71,72.09 41.31,70.5 43.09,70.5 C6.1 47.47,72.4 R16.2 48.86,72.36 49.42,71.8 D6.2
CH1_MOSH  (via drill 0.35)
  Top 0.61: Q6.1 24.76,75.79 v24.75,75.8
  Bottom 0.61: v24.75,75.8 25.91,74.64 IC10.7
CH1_MOSL
  Bottom 0.61: IC10.5 33.19,72 25.25,72 16.5,80.75 16.5,82.91 Q5.1
CH2
  Bottom 0.254: R10.1 49.77,65.94 D8.1 52.12,63.6 D7.2 54.44,63.6 55.05,64.21 R9.1 56.2,63.58 59.15,60.63 61.86,60.63 63.11,61.87 63.11,62.98 IC4.13
CH2_H
  Bottom 0.254: IC11.2 40.77,67.64 C7.1 42.5,66.8 42.95,67.25 51.69,67.25 D7.1 53.99,66.04 R9.2
CH2_L
  Bottom 0.254: D8.2 49.37,63.55 48.81,64.11 R10.2 47.47,64.15 C8.1 43.22,62.38 41.12,62.38 38.71,64.79 IC11.4
CH2_MOSH  (via drill 0.35)
  Top 0.61: v11.5,78.5 11.5,76 11.71,75.79 Q8.1
  Bottom 0.61: v11.5,78.5 16,78.5 23.65,70.85 26.15,70.85 29.36,67.64 IC11.7
CH2_MOSL
  Bottom 0.61: Q7.1 10.46,78.04 11,77.5 15.5,77.5 23.15,69.85 25.8,69.85 30.55,65.09 IC11.5
CS_FLASH  (via drill 0.35)
  Top 0.254: v83.65,28.25 83.65,23.65 84.85,22.45 84.85,20.6 86.05,19.4 86.05,10.67 U1.21/A7
  Bottom 0.254: IC5.1 83.5,32.51 83.5,28.4 v83.65,28.25
CS_MPU1  (via drill 0.35)
  Top 0.254: IC1.P$4 45.46,33.21 44,31.75 44,28.8 45.45,27.35 v45.45,13.85
  Bottom 0.254: v45.45,13.85 45.45,8.2 46.2,7.45 70.13,7.45 U1.16/A2
CS_MPU2  (via drill 0.35)
  Top 0.254: IC2.P$4 55.4,59.28 55.4,43.65 v55.5,43.55
  Bottom 0.254: U1.24 59.46,42.29 58.2,43.55 v55.5,43.55
CS_MS1
  Top 0.254: U1.17/A3 74.7,15.35 70.65,19.4 57.45,19.4 53.45,23.4 51.3,23.4 50.65,24.05 50.65,27.7 51.85,28.9 51.85,43.75 53.08,44.98 IC1.P$1
CS_MS2  (via drill 0.35)
  Top 0.254: IC2.P$1 57.4,64.91 v57.4,42.75
  Bottom 0.254: v57.4,42.75 57.4,42.25 58.55,41.1 58.55,31.2 56.92,29.57 U1.25
CS_TEMP1  (via drill 0.35)
  Top 0.254: v26,15.7 31.5,10.2 38.42,10.2 U1.33/A14 | v12.4,14.6 12.4,15.9 14.05,17.55 v16.9,17.55
  Bottom 0.254: IC6.6 14.18,14.6 v12.4,14.6 | v26,15.7 21.2,15.7 19.35,17.55 v16.9,17.55
CS_TEMP2  (via drill 0.35)
  Top 0.254: U1.34/A15 40.41,10.75 31.95,10.75 v26,16.7
  Bottom 0.254: v26,16.7 22.9,16.7 19.57,20.04 17.71,20.04 16.25,21.5 16.25,23.6 15.21,24.64 IC7.6
FPV_EN  (via drill 0.35)
  Top 0.254: v26,17.7 32.5,11.2 45.04,11.2 U1.36/A17
  Bottom 0.254: IC12.4 15.89,32.09 16.5,32.7 19.9,32.7 25.25,27.35 25.25,18.45 v26,17.7
FPV_MOS
  Bottom 0.254: IC12.5 10.1,32.09 11.5,33.5 11.5,36 14.85,39.35 14.85,48.2 13.89,49.16 Q12.1
GND  (via drill 0.35)
  Top 0.254: J6.2 27.88,6.83 26.75,7.95 23.7,7.95 20.1,4.35 10.15,4.35 8.8,5.7 v8.8,10.9 8.8,18.75 | J5.4 80.12,93.05 v79.55,92.47 | 8.8,18.75 v8.8,20.7 8.8,22.2 8.15,22.85 6.1,22.85 5.42,22.18 J7.7 | 8.8,18.75 8.81,18.76 U2.29
  Bottom 0.254: IC6.1 8.7,12.01 8.8,11.91 v8.8,10.9 | R24.1 84.47,18.92 Z2.2 Z1.2 87.24,18.92 R6.1 | R40.1 72.39,72.83 C2.1 74.84,72.87 R2.1 77.34,72.83 C1.2 | v79.55,92.47 79.12,92.05 77.49,92.05 75.4,89.96 75.4,80.99 73.99,79.58 73.5,79.58 | 8.79,20.71 v8.8,20.7 | C16.1 7.05,17.98 7.05,20.2 | 7.05,20.2 7.56,20.71 8.79,20.71 | C17.1 7.08,24.38 6.4,23.7 6.4,20.85 7.05,20.2 | IC7.1 8.79,20.71 | IC4.7 69.41,66.78 v68.45,65.83 | v56.65,69.15 57.23,69.15 58.6,67.78 C12.1 | Q14.2 79.64,44.95 v79.55,44.86
  Bottom 0.61: SH1.1 SH2.1 SH3.1
  other vias: 81.9,28.25 73.1,52.45 74.3,52.45 75.5,52.45 76.7,52.45 77.9,52.45 79.1,52.45 80.3,52.45 81.5,52.45 73.1,53.45 74.3,53.45 75.5,53.45 76.7,53.45 77.9,53.45 79.1,53.45 80.3,53.45 81.5,53.45
  pour Bottom: 38.8,101.5 38.8,55.45 32.35,55.45 32.35,-1.5 101.5,-1.5 101.5,77.35 73.9,77.35 73.9,101.5
  pour Top: 37.9,102.5 37.9,56.8 22.85,56.8 22.85,11.9 17.6,11.9 17.6,-2.5 101,-2.5 101,68.5 74.5,68.5 74.5,102.5
  pour Route2: 37.5,54.5 41,54.5 41,84 73.95,84 73.95,64.35 109,64.35 109,-6 37.5,-6
HOLD  (via drill 0.35)
  Top 0.254: U1.22/A8 87.4,8.45 86.95,8 84.05,8 83.5,8.55 83.5,10.8 82.4,11.9 82.4,22.7 81,24.1 81,26.65 v75.4,32.25
  Bottom 0.254: v75.4,32.25 76.58,32.25 IC5.7
LED_CTRL  (via drill 0.35)
  Top 0.254: U1.6 79.8,24.74 79.8,26.6 v74.75,31.65 | v65.25,51 v65.25,47.2 | v54.65,53.05 52.85,54.85 52.85,55.95 52.3,56.5 v49.7,56.5
  Bottom 0.254: R27.1 48.37,56.08 Q13.3 49.15,55.95 v49.7,56.5 | v74.75,31.65 73.3,33.1 67.1,33.1 62.35,37.85 62.35,44.3 v65.25,47.2 | v65.25,51 65.25,52.15 64.35,53.05 v54.65,53.05
LIFTOFF_1  (via drill 0.35)
  Top 0.254: v24.52,22.25 26.95,22.25 28.2,21 28.2,19.3 32.55,14.95 35.35,14.95 37.71,12.59 50.29,12.59 50.95,13.25 57,13.25 59.05,15.3 59.05,15.45 | 59.05,15.45 v59.05,18.1 | 59.05,15.45 62.9,11.6 67,11.6 68.3,10.3 68.3,7.9 67.08,6.68 JP1.2 | v15.6,27.1 12.25,23.75 5.55,23.75 4,22.2 4,20.75 4.3,20.45 J7.6
  Bottom 0.254: v24.52,22.25 22.3,22.25 19.45,25.1 17.6,25.1 v15.6,27.1 | R4.2 59.87,18.92 v59.05,18.1
LIFTOFF_1D  (via drill 0.35)
  Top 0.254: v57.5,17.05 57.05,17.05 v53.8,20.3
  Bottom 0.254: R35.1 R4.1 57.53,17.08 v57.5,17.05 | C10.1 66.16,17.08 R35.1 | R35.1 63.59,14.26 64.54,13.31 U1.13 | U2.5 33.92,26.68 46.92,26.68 48.05,25.55 48.05,23.65 50.8,20.9 53.2,20.9 v53.8,20.3
LIFTOFF_2  (via drill 0.35)
  Top 0.254: J6.7 34.12,3.35 v34.6,2.88
  Bottom 0.254: R17.2 68.81,14.86 70.17,13.5 72.6,13.5 73.4,12.7 73.4,5.4 69.7,1.7 57.4,1.7 | v34.6,2.88 41.92,2.88 43.1,1.7 57.4,1.7 | JP2.2 58.2,2.5 57.4,1.7
LIFTOFF_2D  (via drill 0.35)
  Top 0.254: v67.9,20.55 58.3,20.55 v56.65,22.2
  Bottom 0.254: C11.1 73.97,18.92 R36.1 R17.1 68.81,19.64 v67.9,20.55 | U2.6 35.34,27.2 48.35,27.2 49.3,26.25 U1.28 49.3,24.4 50.15,23.55 52.65,23.55 54,22.2 v56.65,22.2
LORA_GND
  pour Bottom: 74.5,104.5 104.5,104.5 104.5,78 74.5,78
  pour Top: 75,105 75,69.05 105,69.05 105,105
  pour Route2: 74.5,108.5 74.5,64.95 109,64.95 109,108.5
MISO0  (via drill 0.35)
  Top 0.254: v27.45,41.55 28.7,42.8 38.6,42.8 45.15,49.35 48.41,49.35 IC1.P$2 50.54,45.79 v49.55,44.8 | IC2.P$2 56.7,63.06 v56.7,49.45
  Bottom 0.254: IC6.7 15.12,13.37 15.6,13.85 15.6,14.2 | 15.6,14.2 16.3,14.9 26.35,14.9 27.45,16 v27.45,41.55 | v56.7,49.45 56.65,49.4 52.55,49.4 50.54,47.39 IC1.P$2 | v49.55,44.8 49.56,44.79 60.46,44.79 61.65,43.6 61.65,29.55 64.3,26.9 64.35,26.9 64.54,26.71 U1.12 | IC7.7 15.04,23.36 15.6,22.8 15.6,14.2
MISO1  (via drill 0.35)
  Top 0.254: U3.2 80.5,68.85 79.5,67.85 72.65,67.85 68.09,63.29 68.09,35.11 v68.1,35.1 | U1.1 92.48,27.37 v89.45,30.4 | v74.65,35.14 82.41,35.14 v85.9,31.65
  Bottom 0.254: v74.65,35.14 68.14,35.14 v68.1,35.1 | 85.39,32.19 85.38,32.17 v85.9,31.65 | 85.39,32.19 87.17,30.4 v89.45,30.4 | IC5.2 85.39,32.19
MOSI0  (via drill 0.35)
  Top 0.254: IC2.P$8 53.08,51.52 54.11,50.49 54.11,50.47 54.55,50.03 54.55,44.85 53.05,43.35 53.05,30.8 IC1.P$8 62.23,30.77 v62.35,30.65
  Bottom 0.254: v62.35,30.65 65.55,27.45 65.55,25.95 66.78,24.72 U1.11
MOSI1  (via drill 0.35)
  Top 0.254: U3.3 82.5,68.7 81.1,67.3 72.9,67.3 68.79,63.19 68.79,35.06 v73.5,30.35 | U1.0 95.02,27.23 90.7,31.55 v90.65,31.55
  Bottom 0.254: v90.65,31.55 90.64,31.54 90.64,27.99 89.65,27 78.3,27 76.65,28.65 IC5.5 74.2,29.65 v73.5,30.35
MPU1_INT  (via drill 0.35)
  Top 0.254: v47.2,13.85 47.2,20.6 48.05,21.45 48.05,27.5 46.7,28.85 46.7,43.25 48,44.55 IC1.P$3
  Bottom 0.254: v47.2,13.85 48,13.05 48,8.3 48.4,7.9 68.04,7.9 U1.15/A1
MPU_INT2  (via drill 0.35)
  Top 0.254: IC2.P$3 56,61.23 56,48.05 56.4,47.65 v56.4,42.75
  Bottom 0.254: v56.4,42.75 56.4,41.7 57.65,40.45 57.65,31.45 54.38,28.18 U1.26
MS_SWITCH  (via drill 0.35)
  Top 0.254: J6.5 31.62,3.55 v32.3,2.88 | v40.98,3.8 43.73,1.05 89.5,1.05 96.25,7.8 96.25,13.25 98.88,15.88 98.88,25.88 v96,28.75 | v89.38,61.62 89.4,61.6 v89.4,57.6 | v92.45,40 92.45,56.95 v92.5,57
  Bottom 0.254: R1.1 91.52,72.8 92.8,72.8 93.35,72.25 93.35,57.85 v92.5,57 90.35,54.85 90.35,49.65 89.15,48.45 86.5,48.45 85.8,49.15 85.8,54 v89.4,57.6 | v32.3,2.88 33.23,3.8 v40.98,3.8 42.9,3.8 44.3,2.4 48.5,2.4 49.33,3.23 JP3.2 | v96,28.75 96,36.45 v92.45,40 | v89.38,61.62 90.67,61.62 Q1.1
N$1
  Top 0.254: LED5.DOUT 45.82,78.15 58.1,78.15 LED6.DIN
N$6
  Bottom 0.254: R2.2 77,70.73 77,65.1 78.4,63.7 81.8,63.7 83.9,61.6 Q2.1 86.45,61.6 88.55,59.5 Q1.3
N$8  (via drill 0.35)
  Top 0.254: v14.3,66.75 15.26,65.79 Q4.1
  Bottom 0.254: Q3.1 15.99,69 R13.1 16.53,69 14.3,66.77 v14.3,66.75
N$10  (via drill 0.35)
  Top 0.254: 19.95,82.5 19,82.5 v18,83.5 16,81.5 15.8,81.5 | v14.5,80.95 14.5,82.8 13.75,83.55
  Top 0.61: LED3.1 19.95,82.5
  Top 2: Q6.2 29,78.05 19.25,78.05 15.8,81.5 13.75,83.55 CON4.2
  Bottom 0.254: 18,83.58 R7.2
  Bottom 0.61: v14.5,80.95 14.54,80.99 Q5.2 | v18,83.5 18,83.58
N$11  (via drill 0.35)
  Top 0.254: LED1.2 18.95,85.55 v18,86.5
  Bottom 0.254: v18,86.5 18.92,87.42 R7.1
N$14  (via drill 0.35)
  Top 0.254: LED4.1 v6.53,83.97 8.75,86.2 8.75,86.45 | v8.5,80.75 8.5,83.55 8.75,83.8
  Top 1.27: Q8.2 18.5,73.5
  Top 2: Q8.2 8.75,83.8 8.75,86.45 CON4.4
  Bottom 0.254: R8.2 6.53,84.06
  Bottom 0.61: Q7.2 8.5,82.91 v8.5,80.75 | 6.53,84.06 v6.53,83.97
N$16  (via drill 0.35)
  Top 0.254: 5.05,85.5 6,85.5 v7,86.5
  Top 0.61: LED2.2 5.05,85.5
  Bottom 0.254: R8.1 6.08,87.42 v7,86.5
N$19
  Bottom 0.254: R14.2 16.55,71.5 Q3.3
N$20  (via drill 3)
  other vias: 97,75
N$26  (via drill 0.35)
  Top 0.254: v18,81.5 19,80.5 19.95,80.5
  Top 0.61: 19.95,80.5 LED3.2
  Bottom 0.254: R11.1 18.92,82.42 v18,81.5
N$28  (via drill 0.35)
  Top 0.254: v7,81.5 6.05,80.55 LED4.2
  Bottom 0.254: R12.1 6.08,82.42 v7,81.5
N$32  (via drill 0.35)
  Top 0.254: TP2.TP 8.05,28 7.11,28.94 J2.1
  Top 0.61: J2.1 3.96,28.94 v3,29.9 v3,30.85
  Bottom 0.254: R20.2 6.42,43.23 6.47,43.18
  Bottom 0.61: Q11.3 7.17,42.75 R20.2 | 6.47,43.18 6.47,41.97 3,38.5 v3,30.85
N$35  (via drill 0.35)
  Top 0.254: TP1.TP 6.6,41.7 6.6,42.7
  Top 0.61: J4.1 6.6,42.7 7.3,42.7 v8.3,43.7 v8.3,44.85
  Bottom 0.61: R21.2 8.3,46 | 8.3,46 v8.3,44.85 | 8.3,46 8.45,46 9.95,47.5 Q12.3
N$39
  Bottom 0.61: IC8.3 79.84,66.5 79.84,71.03 C1.1 81.67,71.08 81.8,70.95 82.4,70.95 D1.2
N$44  (via drill 0.35)
  Top 0.254: v42.05,59.95 40.39,61.61 LED5.DIN
  Bottom 0.254: R30.1 49.59,57.92 Q13.2 49.46,59.04 48.55,59.95 v42.05,59.95
N$45  (via drill 0.35)
  Top 0.254: U2.14 38.77,49.24 41.45,51.92 41.45,56.55 43.65,58.75 43.65,70 44.7,71.05 59.85,71.05 v64.2,75.4
  Bottom 0.254: R28.1 63.5,74.72 64.18,75.4 v64.2,75.4
N$46  (via drill 0.35)
  Top 0.254: v40.6,52.35 40.6,52.31 40.07,51.78 U2.15 | v67.4,56.6 v62.15,56.6
  Bottom 0.254: v40.6,52.35 43.1,54.85 60.4,54.85 v62.15,56.6 | R29.1 69.1,58.3 v67.4,56.6
N$48
  Bottom 0.254: R23.2 R37.1
N$49
  Bottom 0.254: D4.2 77.23,42.78 77.83,42.78 78.5,43.46 78.5,45.5 80.05,47.05 Q14.3 80.25,47.05 LS2.N
N$50
  Bottom 0.254: R38.1 75.58,41.48 77.98,41.48 80,43.5 82.5,43.5 82.95,43.95 Q14.1
N$51
  Bottom 0.254: D9.2 71.6,39.45 Q15.3 80.25,39.45 LS1.N
N$52
  Bottom 0.254: R39.1 74.14,40.5 80,40.5 Q15.1
N$54
  Bottom 0.254: Q2.2 87.91,67.45 87.21,68.15 87.21,72.15 87.96,72.9 D3.1
N$55  (via drill 3)
  other vias: 65,40
N$56  (via drill 3)
  other vias: 35,60
N$57  (via drill 3)
  other vias: 3,75
N$58  (via drill 3)
  other vias: 3,3
N$59  (via drill 3)
  other vias: 97,3
PARA_1A
  Bottom 0.254: IC4.2 63.06,71.64 R28.2 R26.2
PARA_1T  (via drill 0.35)
  Top 0.254: v59.2,22.4 72.2,22.4 73.45,23.65 73.45,27.85 71.9,29.4 65.5,29.4 60.2,34.7 60.2,57.95 63.55,61.3 v63.55,65.83
  Bottom 0.254: R19.2 68.17,72.08 66.99,70.9 65.2,70.9 64.33,70.03 64.33,68.52 64.35,68.5 IC4.3 64.33,66.88 63.55,66.1 v63.55,65.83 | U1.37/A18 49.35,9.53 49.35,12.05 50.55,13.25 53.15,13.25 54.75,14.85 54.75,17.95 v59.2,22.4
PARA_2A
  Bottom 0.254: IC4.11 65.6,62.22 66.6,61.23 R22.2 R29.2
PARA_2T  (via drill 0.35)
  Top 0.254: v59.85,21.7 74,21.7 76,23.7 76,26.25 72.3,29.95 65.7,29.95 60.95,34.7 60.95,57.9 66,62.95 v66,65.83
  Bottom 0.254: R18.2 64.1,61.27 64.3,61.47 64.3,63.01 IC4.12 64.33,64.16 v66,65.83 | U1.38/A19 55.65,13.29 55.65,17.5 v59.85,21.7
PGND  (via drill 0.35)
  Top 0.254: PGND.TP v35.25,63.4
  Top 0.61: CON4.1 16.25,90.5
  Top 1.27: CON4.3 11.25,94.5 16.25,94.5 16.25,90.5
  Top 2.54: CON2.- 11,57 | 11,57 9,57 9,53 12.5,53 12.5,57 11,57
  Bottom 0.254: C5.2 41.1,72.4 40.13,73.36 IC10.3 | C5.2 | C5.2 43.45,72.4 43.75,72.7 43.75,73.85 44.05,74.15 C6.2 | C8.2 44.15,65.9 43.7,65.45 43.7,64.5 43.35,64.15 C7.2 41.8,64.15 39.59,66.36 IC11.3
  Bottom 0.61: v11,87 9.5,85.5 Q7.3 | v16,87 15.5,86.5 Q5.3 | R25.1 17.08,63.54 C4.1 C3.2 17.12,55.12 17.35,54.9 | SH1.2 SH2.2 SH3.2 | IC11.3 36.72,66.36 36.2,65.85 36.2,64.35 v35.25,63.4 | IC10.3 37.06,73.36 34.48,70.78 C19.1
  Bottom 2.54: CON3.- 16.1,8 21.1,13 27.5,13 30.1,15.6 30.1,45.2 IC9.4 20.4,54.9 17.35,54.9 CON2.-
  other vias: 24.62,52.8 24.62,51.81 24.62,50.83 24.62,49.84 24.62,48.86 24.62,47.87 24.62,46.89 24.62,45.9 26.07,52.8 26.07,51.81 26.07,50.83 26.07,49.84 26.07,48.86 26.07,47.87 26.07,46.89 26.07,45.9 27.57,52.75 27.57,51.76 27.57,50.78 27.57,49.79 27.57,48.81 27.57,47.82 27.57,46.84 27.57,45.85 36.3,66.95 36.3,67.85 36.25,68.75
  pour Top: -2.8,102.5 -2.8,-2.3 17,-2.3 17,12.4 20.35,12.4 20.35,57.3 37.3,57.3 37.3,102.5
  pour Bottom: -1.4,101.4 38.3,101.4 38.3,55.95 31.9,55.95 31.9,-1.55 -1.4,-1.55
  pour Route2: -10.5,105 39.5,105 39.5,56.5 35.5,56.5 35.5,-6 -10.5,-6
RFD_EN  (via drill 0.35)
  Top 0.254: v43.05,11.9 42.95,11.8 32.9,11.8 v26,18.7
  Bottom 0.254: IC12.2 16.39,34.63 17.05,35.3 20,35.3 26,29.3 v26,18.7 | U1.35/A16 44.22,10.73 v43.05,11.9
RFD_MOS
  Bottom 0.254: IC12.7 10.13,34.63 10.5,35 10.5,36.25 13.52,39.27 13.52,43.23 13.04,43.71 Q11.1
RFM_ANT
  Top 0.29: U3.9 ANT.1
RFM_INT  (via drill 0.35)
  Top 0.254: U3.14 82.5,84.8 75.95,78.25 v75.65,78.25 | v69.57,77.55 59.44,67.42 59.44,44.1 v59.49,44.05
  Bottom 0.254: v69.57,77.55 70.27,78.25 v75.65,78.25 | U1.39/A20 56.58,11.68 56.58,17.23 60.75,21.4 60.75,42.79 v59.49,44.05
RFM_NSS  (via drill 0.35)
  Top 0.254: U3.5 86.5,68.95 83.8,66.25 73.45,66.25 69.95,62.75 69.95,36.4 v72.05,34.3 | U1.3 87.4,26.6 86.4,27.6 86.4,29.45 81.55,34.3 v75.35,34.3
  Bottom 0.254: v75.35,34.3 v72.05,34.3
RFM_RST
  Top 0.254: U3.6 88.5,68.75 85.45,65.7 73.7,65.7 70.55,62.55 70.55,36.98 74.08,33.45 80.95,33.45 84.8,29.6 84.8,24.78 U1.4
RX1  (via drill 0.35)
  Top 0.254: U1.27 51.84,25.92 52.47,26.55 v67.1,26.55 | v91.45,35.1 91.58,35.23 J1.3
  Bottom 0.254: v67.1,26.55 90.15,26.55 91.5,27.9 91.5,35.05 v91.45,35.1
RX2  (via drill 0.35)
  Top 0.254: J2.3 14.46,31.44 v15.6,30.3 | v24.52,25.15 29.65,25.15 32.2,27.7 35.65,27.7 v36,28.05 | v53.25,28.8 71.55,28.8 72.16,28.19 U1.9
  Bottom 0.254: v15.6,30.3 15.7,30.2 19.9,30.2 24.52,25.57 v24.52,25.15 | v53.25,28.8 36.75,28.8 v36,28.05
RX3  (via drill 0.35)
  Top 0.254: v97.5,63.05 97.45,63.1 94.58,63.1 J3.3
  Bottom 0.254: v97.5,63.05 97.5,62.1 96.1,60.7 96.1,56.74 94.92,55.56 94.92,38.79 96.8,36.91 96.8,28.35 96.05,27.6 93.25,27.6 91.2,25.55 91.2,23.8 90.85,23.45 78.51,23.45 U1.7
SCK0  (via drill 0.35)
  Top 0.254: v26.7,20.8 v24.52,20.8 24.52,16.07 30.85,9.75 35.7,9.75 37.75,7.7 65.3,7.7 U1.14/A0 | v26.7,43.8 28.3,45.4 40.4,45.4 45.5,50.5 48.1,50.5 v48.45,50.85 | IC1.P$7 50.54,44.04 51.8,45.3 51.8,50.27 50.54,51.52 IC2.P$7
  Bottom 0.254: IC6.5 13.1,15.9 12.7,16.3 12.7,25.35 13.26,25.91 IC7.5 15.24,25.91 16.95,24.2 16.95,23.2 17.55,22.6 19.6,22.6 21.4,20.8 v24.52,20.8 | v26.7,43.8 v26.7,20.8 | v48.45,50.85 50.38,52.77 IC2.P$7
SCK1  (via drill 0.35)
  Top 0.254: U3.4 84.5,68.75 82.5,66.75 73.1,66.75 69.37,63.02 69.37,35.73 v74.1,31 78.4,26.7 78.4,14.1 82.3,10.2 82.3,9.5 U1.20/A6
  Bottom 0.254: v74.1,31 74.19,30.91 IC5.6
SCL0  (via drill 0.35)
  Top 0.254: J2.4 11.89,32.69 v15.9,36.7 | v24.5,37.8 v40.3,37.8 | v42.12,6.25 46.67,1.7 75.1,1.7 v78.6,5.2 78.65,5.25 v90.35,5.25 | v40.35,13.85 42.9,16.4 42.9,32.5 v44.2,33.8 | J3.4 97.24,61.88 v98.2,60.92 | J1.4 98.67,33.98 v98.85,33.8
  Bottom 0.254: Q10.3 48.87,35.58 R33.1 43.97,35.55 43.85,35.55 | v15.9,36.7 17,37.8 v24.5,37.8 | v40.3,37.8 42.55,35.55 43.85,35.55 | v40.35,13.85 40.35,8.03 v42.12,6.25 | v44.2,33.8 44.2,35.2 43.85,35.55 | v98.2,60.92 98.2,56.85 96.35,55 96.35,39.4 98.85,36.9 v98.85,33.8 98.85,23.95 97.1,22.2 97.1,12.45 98.85,10.7 98.85,8.65 95.45,5.25 v90.35,5.25 | U1.19/A5 79.78,6.38 v78.6,5.2
SCL0_H  (via drill 0.35)
  Top 0.254: J5.2 82.62,92.95 v82.15,92.47 | v68.53,77.55 58.8,67.82 58.8,39.1 57,37.3 v55.55,37.3
  Bottom 0.254: Q10.2 50.09,37.42 R34.1 53.12,37.3 v55.55,37.3 | v82.15,92.47 80.83,91.15 77.85,91.15 76.3,89.6 76.3,80.45 74.55,78.7 69.68,78.7 v68.53,77.55
SDA0  (via drill 0.35)
  Top 0.254: J2.5 11.14,33.94 v14.65,37.45 | v24.5,40.35 v41.55,40.35 | v44.75,6.3 48.8,2.25 72.6,2.25 77.24,6.89 77.24,7.05 | J3.5 96.72,60.62 v97.5,59.85 | J1.5 97.78,32.73 v98.15,32.35 | U1.18/A4 77.24,7.05 | v92.25,7.1 77.29,7.1 77.24,7.05 | v40.35,14.9 40.35,35.9 v43.05,38.6
  Bottom 0.254: Q9.3 44.13,40.45 44.06,40.52 | 44.06,40.52 R31.1 43.77,40.35 v41.55,40.35 | v14.65,37.45 17.55,40.35 v24.5,40.35 | v44.75,6.3 42.85,8.2 42.85,10.75 42.1,11.5 42.1,13.15 v40.35,14.9 | v43.05,38.6 44.06,39.62 44.06,40.52 | v97.5,59.85 97.5,56.85 95.9,55.25 95.9,39.2 98.15,36.95 v98.15,32.35 98.15,27.37 96.25,25.47 96.25,8.6 94.75,7.1 v92.25,7.1
SDA0_H  (via drill 0.35)
  Top 0.254: J5.3 81.38,93 v80.85,92.47 | v67.5,77.55 58.25,68.3 58.25,42.15 57,40.9 v55.55,40.9
  Bottom 0.254: Q9.2 50.09,42.42 R32.1 53.5,42.42 55.02,40.9 v55.55,40.9 | v80.85,92.47 79.97,91.6 77.65,91.6 75.85,89.8 75.85,80.65 74.35,79.15 69.1,79.15 v67.5,77.55
SHIELD  (1 unrouted)
T1+  (via drill 0.35)
  Top 0.254: v7.12,15.95 7.12,16.2 6.62,16.7 J7.3
  Bottom 0.254: IC6.3 8.65,14.5 7.5,14.5 7.12,14.88 v7.12,15.95
T1-  (via drill 0.35)
  Top 0.254: v7.12,13.5 7.12,14.88 6.55,15.45 J7.2
  Bottom 0.254: IC6.2 8.65,13.5 v7.12,13.5
T2+  (via drill 0.35)
  Top 0.254: v7.12,21.55 7.12,19.93 6.4,19.2 J7.5
  Bottom 0.254: IC7.3 8.38,24.64 7.12,23.38 v7.12,21.55
T2-  (via drill 0.35)
  Top 0.254: v7.88,19.75 7.88,19.25 6.58,17.95 J7.4
  Bottom 0.254: IC7.2 9.63,23.36 10.2,22.8 10.2,20.7 9.25,19.75 v7.88,19.75
TX1  (via drill 0.35)
  Top 0.254: J1.2 92.58,36.48 v92.45,36.6
  Bottom 0.254: U1.5 83.7,26.1 90.65,26.1 92.4,27.85 92.4,36.55 v92.45,36.6
TX2  (via drill 0.35)
  Top 0.254: v8.2,30.15 8.16,30.19 J2.2 | v24.52,23.7 30.75,23.7 32.15,25.1 35.8,25.1 37.7,27 v37.7,27.95 | v53.25,27.95 68.35,27.95 69.62,26.68 U1.10
  Bottom 0.254: v24.52,23.7 23.4,23.7 19.45,27.65 16.35,27.65 13.4,30.6 8.65,30.6 v8.2,30.15 | v37.7,27.95 v53.25,27.95
TX3  (via drill 0.35)
  Top 0.254: v98.2,61.98 98.2,63.35 97.17,64.38 J3.2
  Bottom 0.254: U1.8 76.47,22.95 92.85,22.95 93.8,23.9 93.8,25.7 94.75,26.65 96.24,26.65 97.43,27.84 97.43,36.97 95.4,39 95.4,55.4 96.78,56.78 96.78,60.56 v98.2,61.98
TX4  (via drill 0.35)
  Top 0.254: U1.32/A13 39.14,31.52 35.36,35.3 v24.5,35.3 | J4.2 6.35,43.95 6.8,44.4 6.8,45.05 8.2,46.45 12.5,46.45 15.59,43.36 v15.59,43.35
  Bottom 0.254: v24.5,35.3 25.7,36.5 25.7,40.95 23.75,42.9 16.04,42.9 v15.59,43.35
VUSB1  (via drill 0.35)
  Top 0.254: v84.25,62.65 84.25,44 88.65,39.6 88.65,29.5 91.21,26.94 U1.VUSB1 95.02,17.73 U1.VUSB
  Bottom 0.254: D2.2 85.6,63.55 84.7,62.65 v84.25,62.65
WP  (via drill 0.35)
  Top 0.254: v85.6,28.25 85.6,26.85 86.1,26.35 86.1,23.65 87.4,22.35 87.4,20.6 91.35,16.65 91.35,10.89 U1.23/A9
  Bottom 0.254: IC5.3 85.6,29.77 v85.6,28.25

## Text on the board
tPlace: Mjollnir | Flight Controller / version 1.0
tNames: Never power up / without antenna | 2 | 1 | Unless this chip / is absent :) | safe | Parachutes | GNSS | Status | TM/GNSS | BAT2 | BAT1 | FPV | TM/GNSS | TM/GNSS | Temp. | Eng. Comp. | Designed in Sweden